# Altium schematic sheet isg_eos_control_board_xem3001.SchDoc
size D
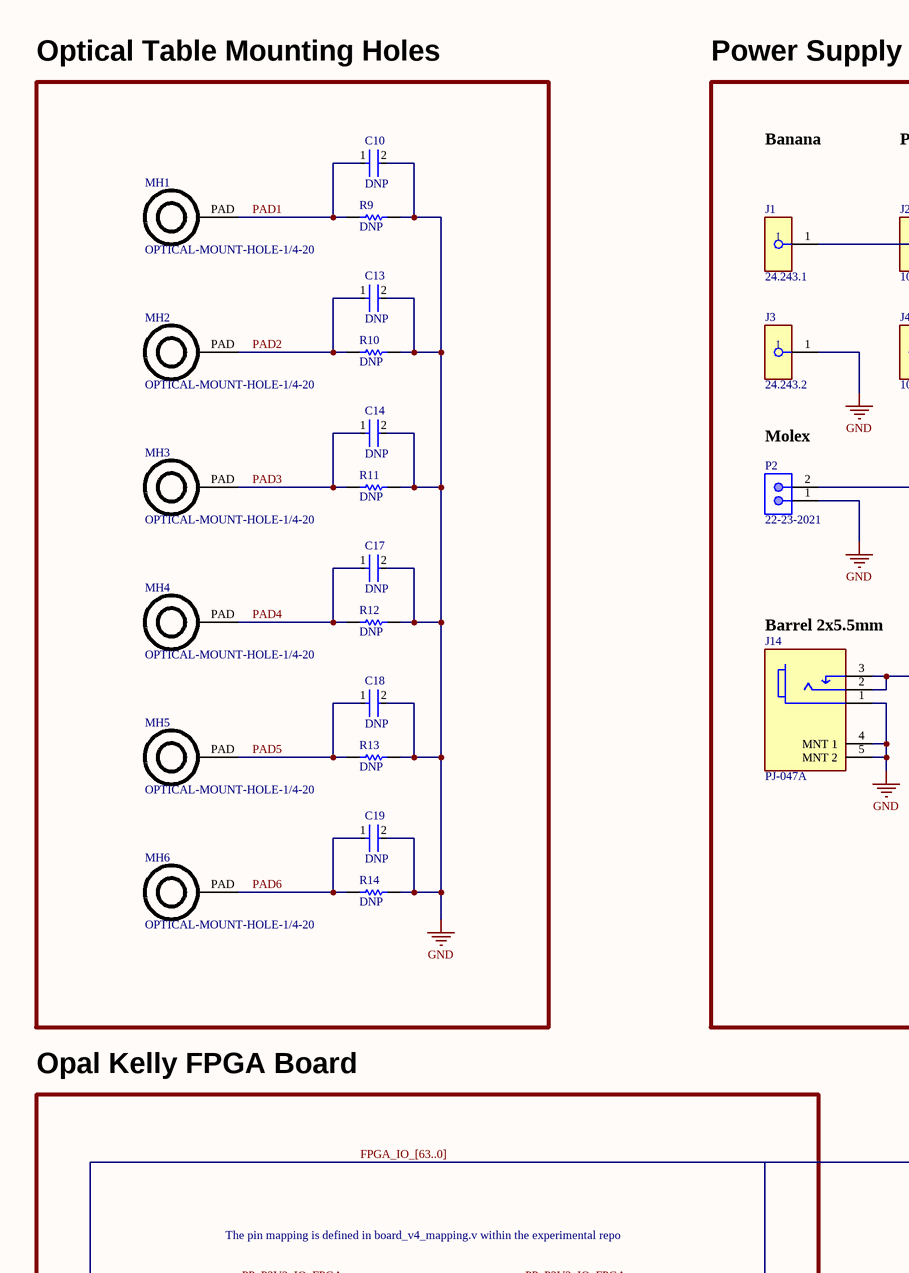
[diagram p0: isg_eos_control_board_xem3001.SchDoc, top left]
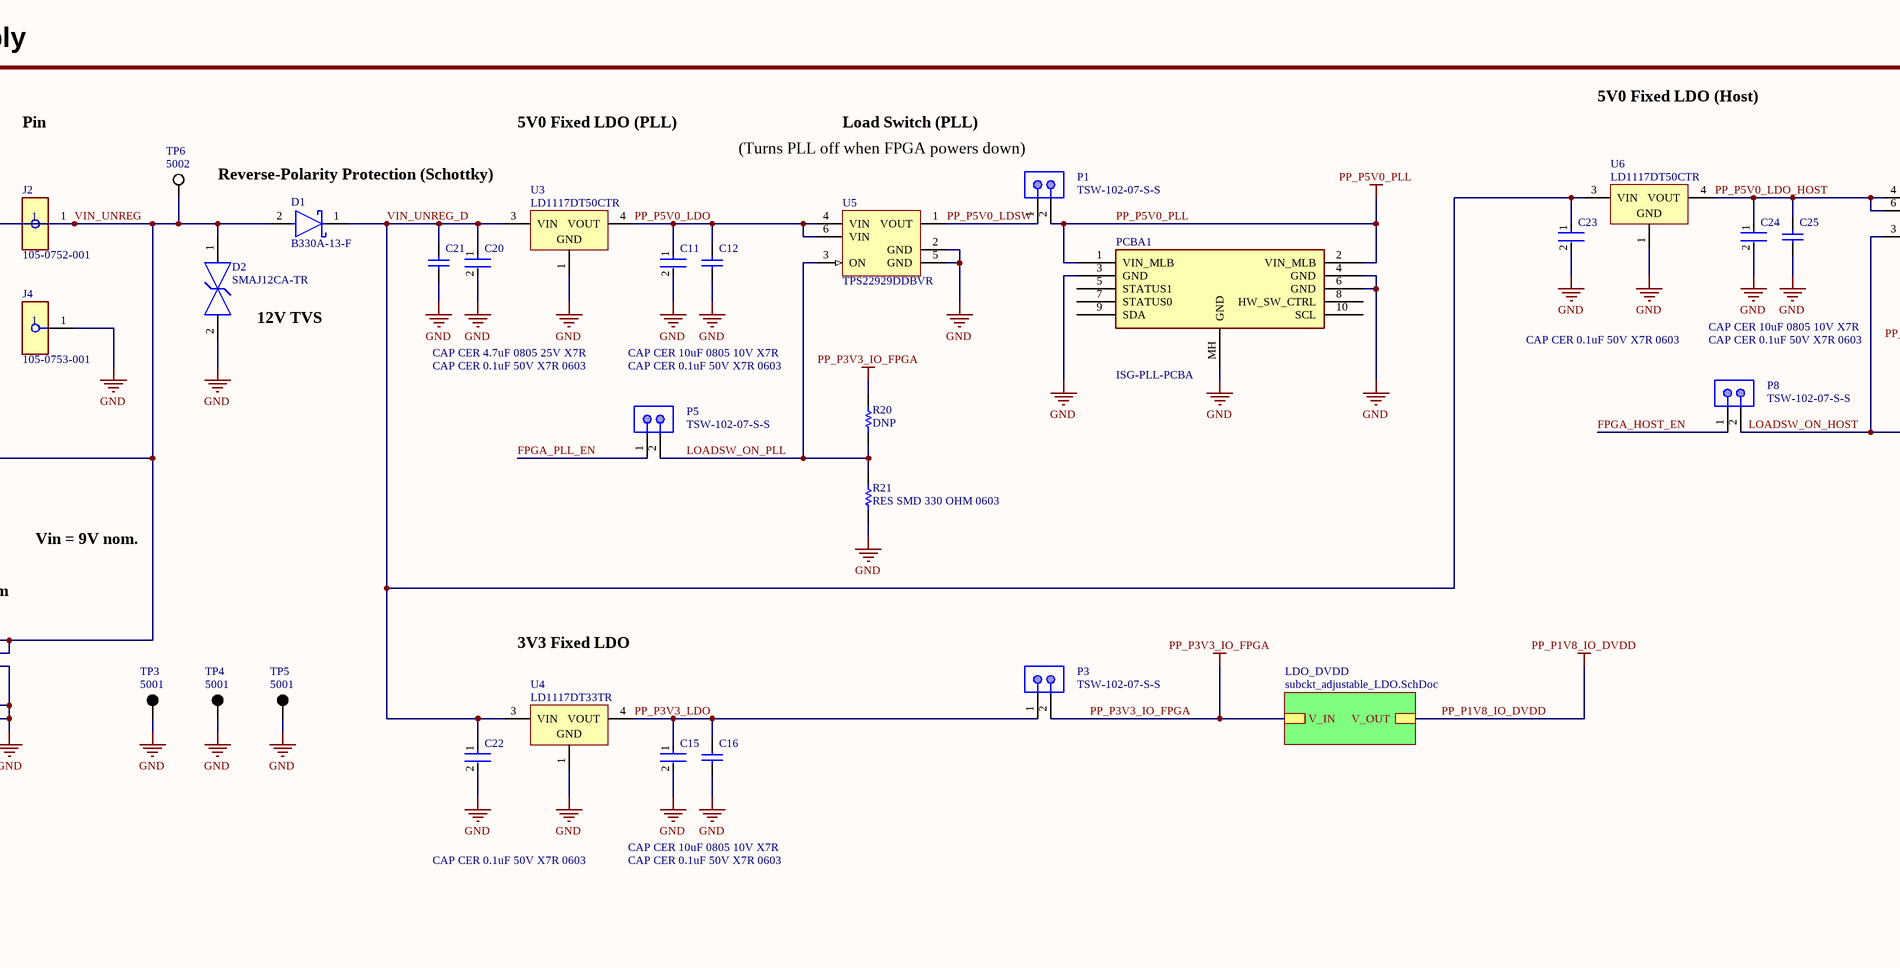
[diagram p1: isg_eos_control_board_xem3001.SchDoc, top middle]
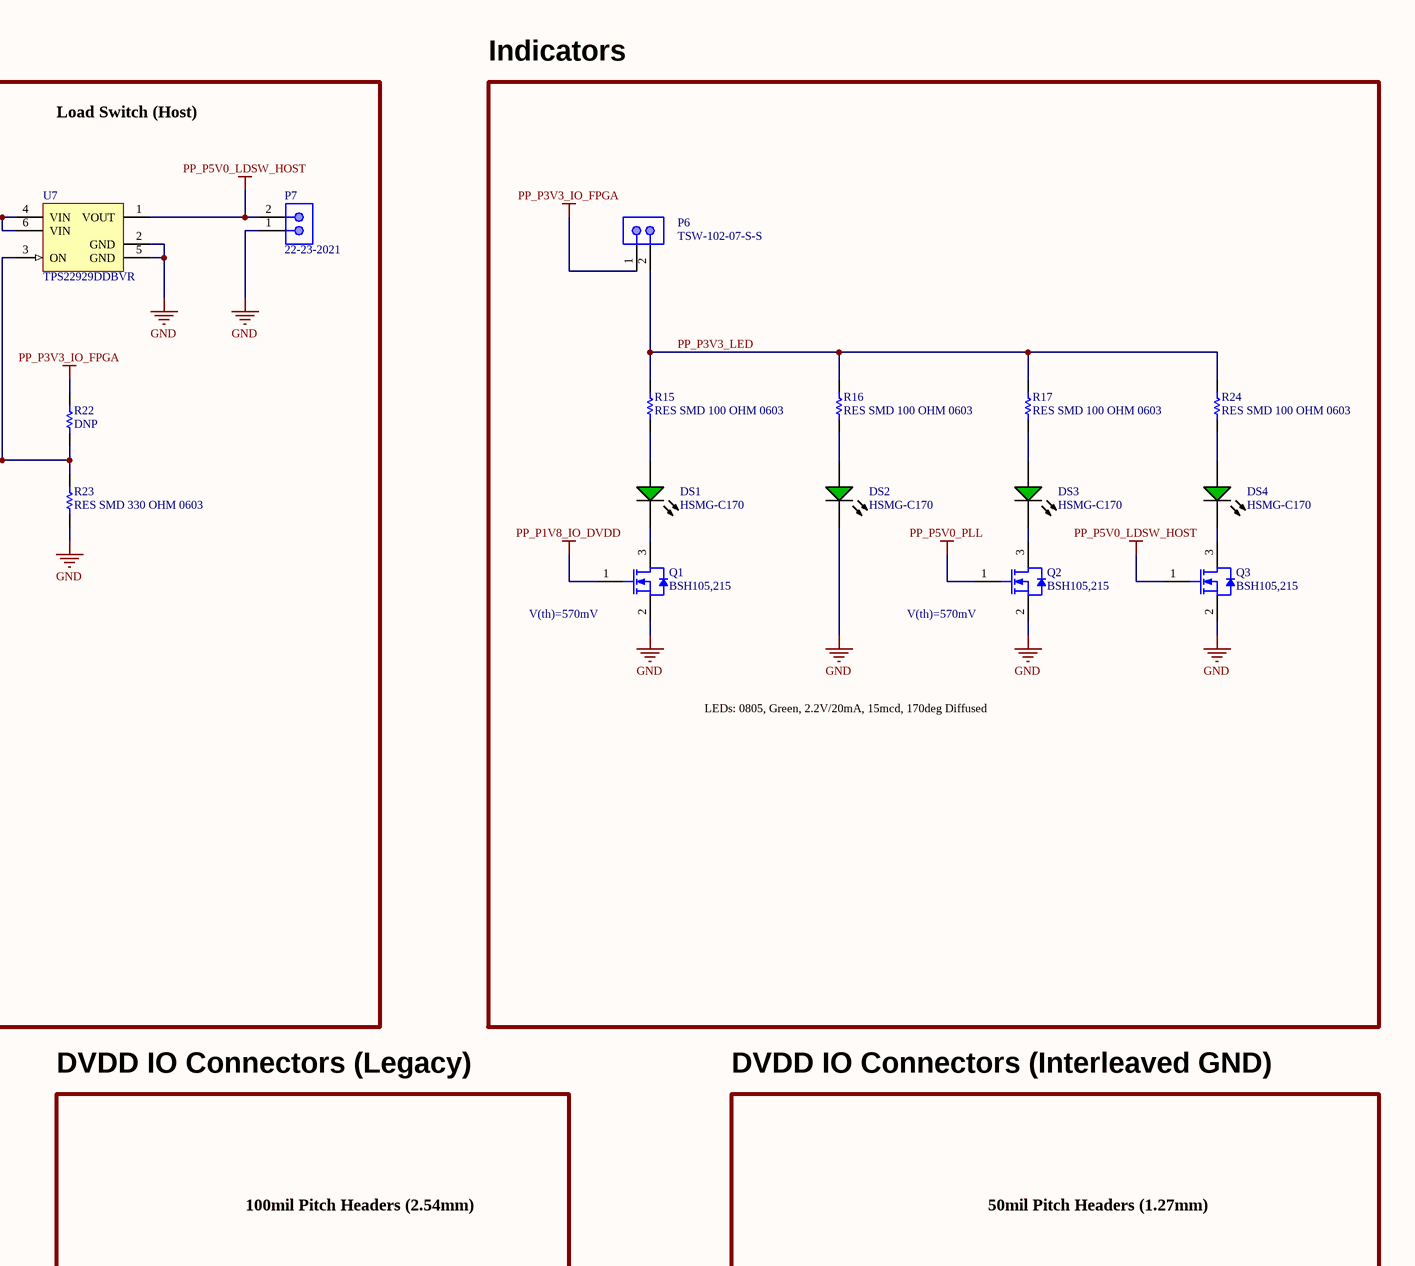
[diagram p2: isg_eos_control_board_xem3001.SchDoc, top right]
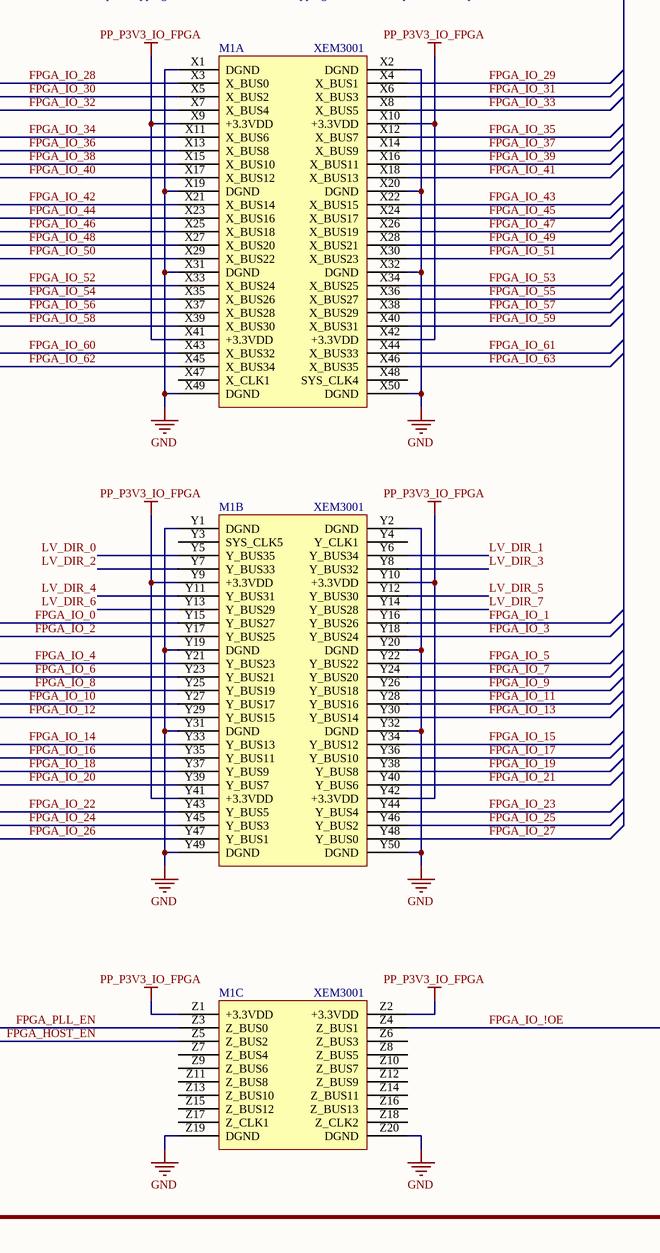
[diagram p3: isg_eos_control_board_xem3001.SchDoc, bottom left]
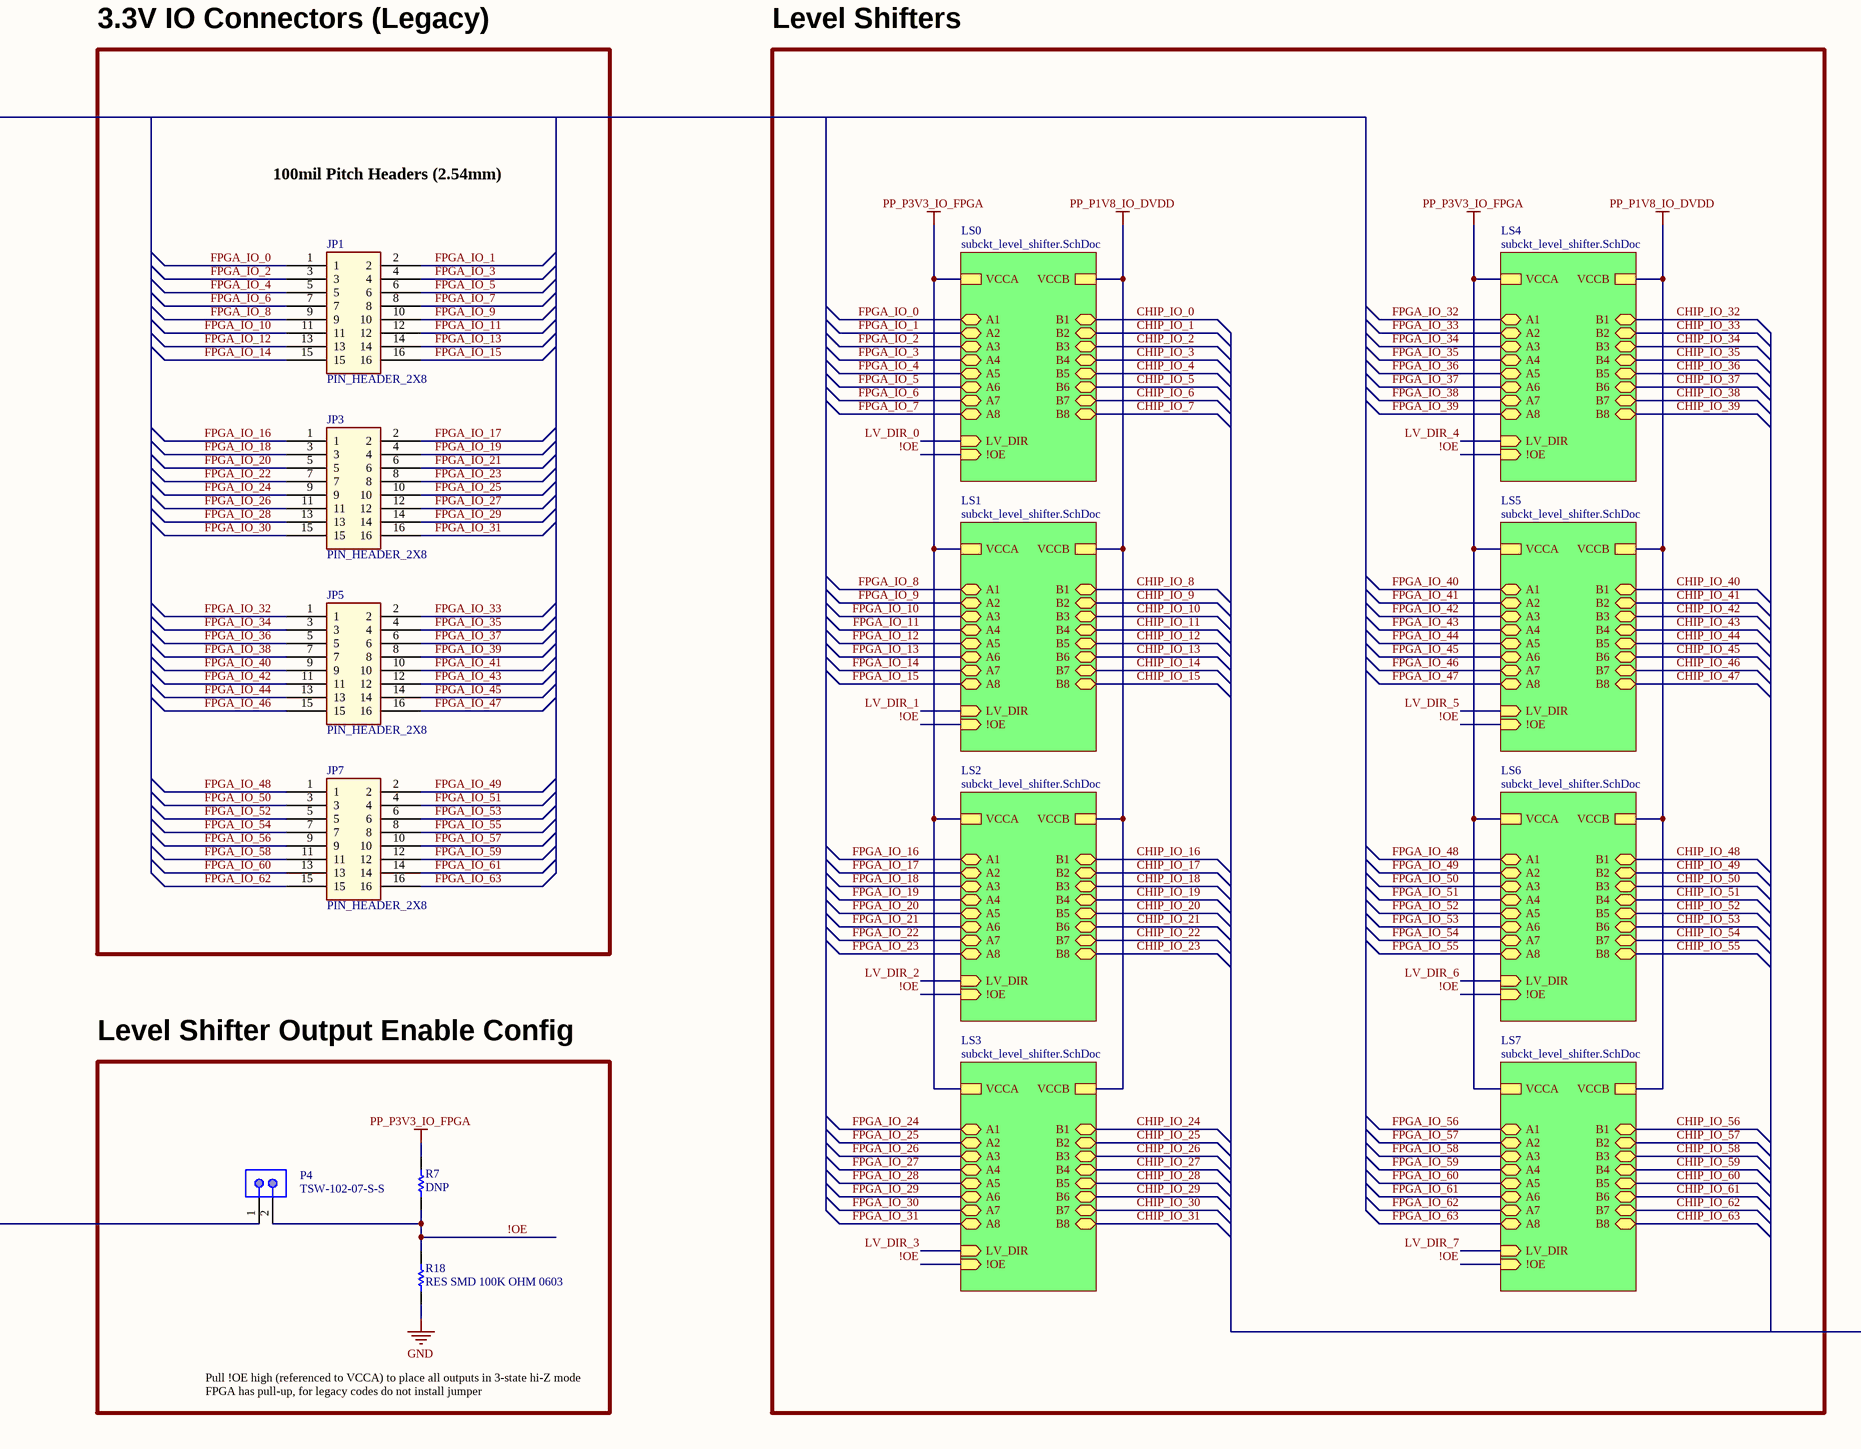
[diagram p4: isg_eos_control_board_xem3001.SchDoc, bottom middle]
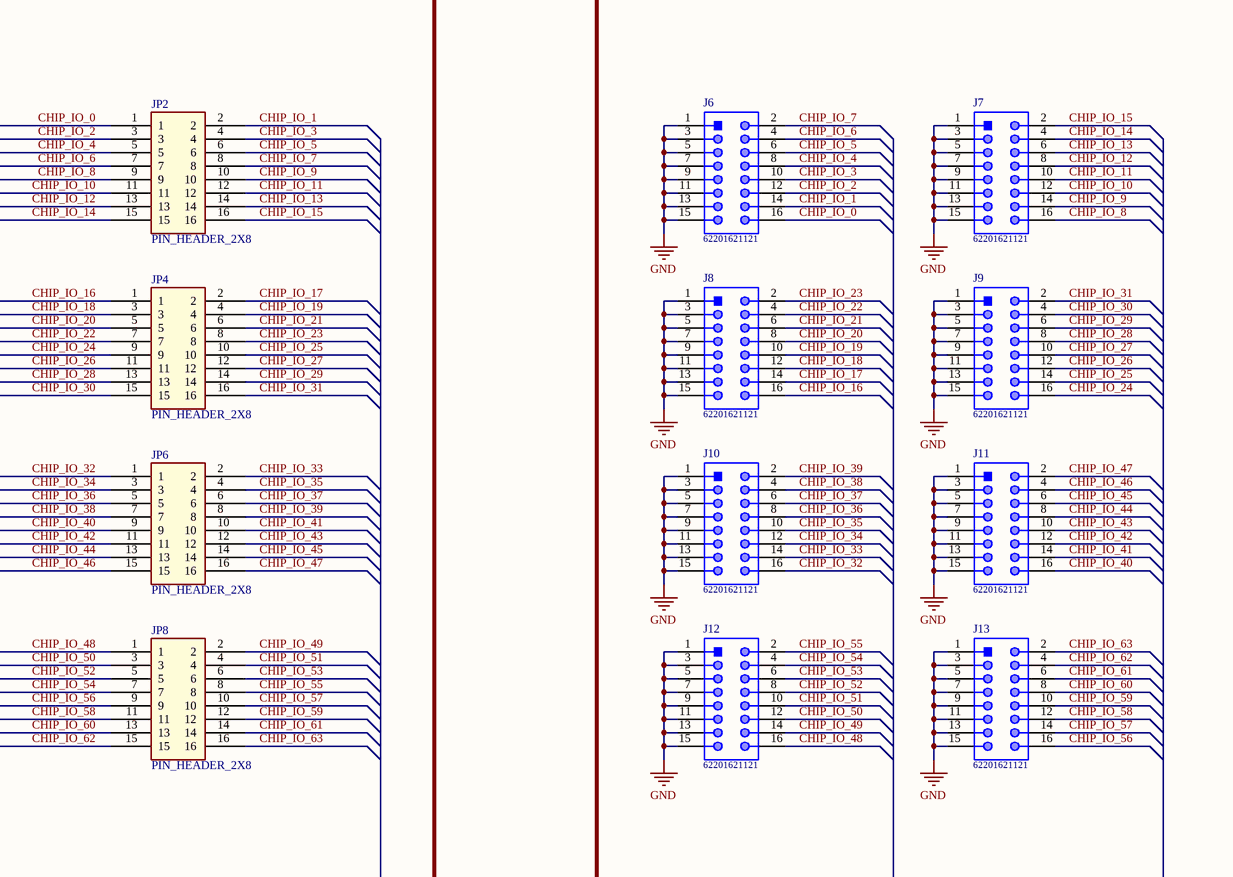
[diagram p5: isg_eos_control_board_xem3001.SchDoc, bottom right]

## Parts
C10  DNP  [FP-CC0603-DA-MFG]
C11  CAP CER 0.1uF 50V X7R 0603  [FP-CC0603-DA-MFG]
C12  CAP CER 10uF 0805 10V X7R  [CAPC2013X140X50NL20T25]
C13  DNP  [FP-CC0603-DA-MFG]
C14  DNP  [FP-CC0603-DA-MFG]
C15  CAP CER 0.1uF 50V X7R 0603  [FP-CC0603-DA-MFG]
C16  CAP CER 10uF 0805 10V X7R  [CAPC2013X140X50NL20T25]
C17  DNP  [FP-CC0603-DA-MFG]
C18  DNP  [FP-CC0603-DA-MFG]
C19  DNP  [FP-CC0603-DA-MFG]
C20  CAP CER 0.1uF 50V X7R 0603  [FP-CC0603-DA-MFG]
C21  CAP CER 4.7uF 0805 25V X7R  [CAPC2013X140X50NL20T25]
C22  CAP CER 0.1uF 50V X7R 0603  [FP-CC0603-DA-MFG]
C23  CAP CER 0.1uF 50V X7R 0603  [FP-CC0603-DA-MFG]
C24  CAP CER 0.1uF 50V X7R 0603  [FP-CC0603-DA-MFG]
C25  CAP CER 10uF 0805 10V X7R  [CAPC2013X140X50NL20T25]
D1  B330A-13-F  [FP-SMA-MFG]
D2  SMAJ12CA-TR  [FP-SMA-CA-MFG]
DS1  HSMG-C170  [AVAG-HSMX-C170_V]
DS2  HSMG-C170  [AVAG-HSMX-C170_V]
DS3  HSMG-C170  [AVAG-HSMX-C170_V]
DS4  HSMG-C170  [AVAG-HSMX-C170_V]
J1  24.243.1  [FP-24_243_1-MFG]
J2  105-0752-001  [FP-105-0751-001-MFG]
J3  24.243.2  [FP-24_243_2-MFG]
J4  105-0753-001  [FP-105-0751-001-MFG]
J6  62201621121  [62201621121]
J7  62201621121  [62201621121]
J8  62201621121  [62201621121]
J9  62201621121  [62201621121]
J10  62201621121  [62201621121]
J11  62201621121  [62201621121]
J12  62201621121  [62201621121]
J13  62201621121  [62201621121]
J14  PJ-047A  [FP-PJ-047A-MFG]
JP1  PIN_HEADER_2X8  [PIN_HEADER_2X8_2.54MM]
JP2  PIN_HEADER_2X8  [PIN_HEADER_2X8_2.54MM]
JP3  PIN_HEADER_2X8  [PIN_HEADER_2X8_2.54MM]
JP4  PIN_HEADER_2X8  [PIN_HEADER_2X8_2.54MM]
JP5  PIN_HEADER_2X8  [PIN_HEADER_2X8_2.54MM]
JP6  PIN_HEADER_2X8  [PIN_HEADER_2X8_2.54MM]
JP7  PIN_HEADER_2X8  [PIN_HEADER_2X8_2.54MM]
JP8  PIN_HEADER_2X8  [PIN_HEADER_2X8_2.54MM]
M1  XEM3001  [XEM3001MODULE]  (parts A,B,C of 3)
MH1  OPTICAL-MOUNT-HOLE-1/4-20  [MH-1/4-20]
MH2  OPTICAL-MOUNT-HOLE-1/4-20  [MH-1/4-20]
MH3  OPTICAL-MOUNT-HOLE-1/4-20  [MH-1/4-20]
MH4  OPTICAL-MOUNT-HOLE-1/4-20  [MH-1/4-20]
MH5  OPTICAL-MOUNT-HOLE-1/4-20  [MH-1/4-20]
MH6  OPTICAL-MOUNT-HOLE-1/4-20  [MH-1/4-20]
P1  TSW-102-07-S-S  [SMTC-TSW-102-07-S-S]
P2  22-23-2021  [MOLX-22-23-2021_V]
P3  TSW-102-07-S-S  [SMTC-TSW-102-07-S-S]
P4  TSW-102-07-S-S  [SMTC-TSW-102-07-S-S]
P5  TSW-102-07-S-S  [SMTC-TSW-102-07-S-S]
P6  TSW-102-07-S-S  [SMTC-TSW-102-07-S-S]
P7  22-23-2021  [MOLX-22-23-2021_V]
P8  TSW-102-07-S-S  [SMTC-TSW-102-07-S-S]
PCBA1  ISG-PLL-PCBA  [ISG-PLL-PCBA]
Q1  BSH105,215  [NXP-SOT23_M]
Q2  BSH105,215  [NXP-SOT23_M]
Q3  BSH105,215  [NXP-SOT23_M]
R7  DNP  [RESC1609X50X30LL10T20]
R9  DNP  [RESC1609X50X30LL10T20]
R10  DNP  [RESC1609X50X30LL10T20]
R11  DNP  [RESC1609X50X30LL10T20]
R12  DNP  [RESC1609X50X30LL10T20]
R13  DNP  [RESC1609X50X30LL10T20]
R14  DNP  [RESC1609X50X30LL10T20]
R15  RES SMD 100 OHM 0603  [RESC1609X50X30LL10T20]
R16  RES SMD 100 OHM 0603  [RESC1609X50X30LL10T20]
R17  RES SMD 100 OHM 0603  [RESC1609X50X30LL10T20]
R18  RES SMD 100K OHM 0603  [RESC1609X50X30LL10T20]
R20  DNP  [RESC1609X50X30LL10T20]
R21  RES SMD 330 OHM 0603  [RESC1609X50X30LL10T20]
R22  DNP  [RESC1609X50X30LL10T20]
R23  RES SMD 330 OHM 0603  [RESC1609X50X30LL10T20]
R24  RES SMD 100 OHM 0603  [RESC1609X50X30LL10T20]
TP3  5001  [KSTN-5001]
TP4  5001  [KSTN-5001]
TP5  5001  [KSTN-5001]
TP6  5002  [KSTN-5002]
U3  LD1117DT50CTR  [TO-252_N]
U4  LD1117DT33TR  [TO-252_N]
U5  TPS22929DDBVR  [DBV0006A_M]
U6  LD1117DT50CTR  [TO-252_N]
U7  TPS22929DDBVR  [DBV0006A_M]

## Blocks framed on the sheet
Optical Table Mounting Holes: C10 C13 C14 C17-C19 MH1-MH6 R9-R14
Power Supply: C11 C12 C15 C16 C20-C25 D1 D2 J1-J4 J14 P1-P3 P5 P7 P8 PCBA1 R20-R23 TP3-TP6 U3-U7
Indicators: DS1-DS4 P6 Q1-Q3 R15-R17 R24
Opal Kelly FPGA Board: M1
3.3V IO Connectors (Legacy): JP1 JP3 JP5 JP7
DVDD IO Connectors (Legacy): JP2 JP4 JP6 JP8
DVDD IO Connectors (Interleaved GND): J6-J13
Level Shifter Output Enable Config: P4 R7 R18

## Sub-sheets
LDO_DVDD = subckt_adjustable_LDO.SchDoc: V_IN, V_OUT
LS0 = subckt_level_shifter.SchDoc: A1 (bidir), A2 (bidir), A3 (bidir), A4 (bidir), A5 (bidir), A6 (bidir), A7 (bidir), A8 (bidir), LV_DIR (in), !OE (in), VCCA, VCCB, B1 (bidir), B2 (bidir), B3 (bidir), B4 (bidir), B5 (bidir), B6 (bidir), B7 (bidir), B8 (bidir)
LS1 = subckt_level_shifter.SchDoc: A1 (bidir), A2 (bidir), A3 (bidir), A4 (bidir), A5 (bidir), A6 (bidir), A7 (bidir), A8 (bidir), LV_DIR (in), !OE (in), VCCA, VCCB, B1 (bidir), B2 (bidir), B3 (bidir), B4 (bidir), B5 (bidir), B6 (bidir), B7 (bidir), B8 (bidir)
LS2 = subckt_level_shifter.SchDoc: A1 (bidir), A2 (bidir), A3 (bidir), A4 (bidir), A5 (bidir), A6 (bidir), A7 (bidir), A8 (bidir), LV_DIR (in), !OE (in), VCCA, VCCB, B1 (bidir), B2 (bidir), B3 (bidir), B4 (bidir), B5 (bidir), B6 (bidir), B7 (bidir), B8 (bidir)
LS3 = subckt_level_shifter.SchDoc: A1 (bidir), A2 (bidir), A3 (bidir), A4 (bidir), A5 (bidir), A6 (bidir), A7 (bidir), A8 (bidir), LV_DIR (in), !OE (in), VCCA, VCCB, B1 (bidir), B2 (bidir), B3 (bidir), B4 (bidir), B5 (bidir), B6 (bidir), B7 (bidir), B8 (bidir)
LS4 = subckt_level_shifter.SchDoc: A1 (bidir), A2 (bidir), A3 (bidir), A4 (bidir), A5 (bidir), A6 (bidir), A7 (bidir), A8 (bidir), LV_DIR (in), !OE (in), VCCA, VCCB, B1 (bidir), B2 (bidir), B3 (bidir), B4 (bidir), B5 (bidir), B6 (bidir), B7 (bidir), B8 (bidir)
LS5 = subckt_level_shifter.SchDoc: A1 (bidir), A2 (bidir), A3 (bidir), A4 (bidir), A5 (bidir), A6 (bidir), A7 (bidir), A8 (bidir), LV_DIR (in), !OE (in), VCCA, VCCB, B1 (bidir), B2 (bidir), B3 (bidir), B4 (bidir), B5 (bidir), B6 (bidir), B7 (bidir), B8 (bidir)
LS6 = subckt_level_shifter.SchDoc: A1 (bidir), A2 (bidir), A3 (bidir), A4 (bidir), A5 (bidir), A6 (bidir), A7 (bidir), A8 (bidir), LV_DIR (in), !OE (in), VCCA, VCCB, B1 (bidir), B2 (bidir), B3 (bidir), B4 (bidir), B5 (bidir), B6 (bidir), B7 (bidir), B8 (bidir)
LS7 = subckt_level_shifter.SchDoc: A1 (bidir), A2 (bidir), A3 (bidir), A4 (bidir), A5 (bidir), A6 (bidir), A7 (bidir), A8 (bidir), LV_DIR (in), !OE (in), VCCA, VCCB, B1 (bidir), B2 (bidir), B3 (bidir), B4 (bidir), B5 (bidir), B6 (bidir), B7 (bidir), B8 (bidir)

## Nets
GND: C10.2 C11.2 C12.2 C13.2 C14.2 C15.2 C16.2 C17.2 C18.2 C19.2 C20.2 C21.2 C22.2 C23.2 C24.2 C25.2 D2.2 DS2.2(K) J3.1 J4.1 J6.1 J6.3 J6.5 J6.7 J6.9 J6.11 J6.13 J6.15 J7.1 J7.3 J7.5 J7.7 J7.9 J7.11 J7.13 J7.15 J8.1 J8.3 J8.5 J8.7 J8.9 J8.11 J8.13 J8.15 J9.1 J9.3 J9.5 J9.7 J9.9 J9.11 J9.13 J9.15 J10.1 J10.3 J10.5 J10.7 J10.9 J10.11 J10.13 J10.15 J11.1 J11.3 J11.5 J11.7 J11.9 J11.11 J11.13 J11.15 J12.1 J12.3 J12.5 J12.7 J12.9 J12.11 J12.13 J12.15 J13.1 J13.3 J13.5 J13.7 J13.9 J13.11 J13.13 J13.15 J14.1 J14.4(MNT_1) J14.5(MNT_2) M1.X1(DGND) M1.X2(DGND) M1.X19(DGND) M1.X20(DGND) M1.X31(DGND) M1.X32(DGND) M1.X49(DGND) M1.X50(DGND) M1.Y1(DGND) M1.Y2(DGND) M1.Y19(DGND) M1.Y20(DGND) M1.Y31(DGND) M1.Y32(DGND) M1.Y49(DGND) M1.Y50(DGND) M1.Z19(DGND) M1.Z20(DGND) P2.1 P7.1 PCBA1.3(GND) PCBA1.4(GND) PCBA1.6(GND) PCBA1.MH(GND) Q1.2(S) Q2.2(S) Q3.2(S) R9.2 R10.2 R11.2 R12.2 R13.2 R14.2 R18.2 R21.2 R23.2 TP3.1 TP4.1 TP5.1 U3.1(GND) U4.1(GND) U5.2(GND) U5.5(GND) U6.1(GND) U7.2(GND) U7.5(GND)
PP_P1V8_IO_DVDD: Q1.1(G) ; sheet LDO_DVDD/V_OUT, sheet LS0/VCCB, sheet LS1/VCCB, sheet LS2/VCCB, sheet LS3/VCCB, sheet LS4/VCCB, sheet LS5/VCCB, sheet LS6/VCCB, sheet LS7/VCCB
PP_P3V3_IO_FPGA: M1.X9(+3.3VDD) M1.X10(+3.3VDD) M1.X41(+3.3VDD) M1.X42(+3.3VDD) M1.Y9(+3.3VDD) M1.Y10(+3.3VDD) M1.Y41(+3.3VDD) M1.Y42(+3.3VDD) M1.Z1(+3.3VDD) M1.Z2(+3.3VDD) P3.2 P6.1 R7.1 R20.1 R22.1 ; sheet LDO_DVDD/V_IN, sheet LS0/VCCA, sheet LS1/VCCA, sheet LS2/VCCA, sheet LS3/VCCA, sheet LS4/VCCA, sheet LS5/VCCA, sheet LS6/VCCA, sheet LS7/VCCA
PP_P5V0_LDSW_HOST: P7.2 Q3.1(G) U7.1(VOUT)
PP_P5V0_PLL: P1.2 PCBA1.1(VIN_MLB) PCBA1.2(VIN_MLB) Q2.1(G)
!OE: P4.2 R7.2 R18.1 ; sheet LS0/!OE, sheet LS1/!OE, sheet LS2/!OE, sheet LS3/!OE, sheet LS4/!OE, sheet LS5/!OE, sheet LS6/!OE, sheet LS7/!OE
CHIP_IO_0: J6.16 JP2.1 ; sheet LS0/B1
CHIP_IO_1: J6.14 JP2.2 ; sheet LS0/B2
CHIP_IO_2: J6.12 JP2.3 ; sheet LS0/B3
CHIP_IO_3: J6.10 JP2.4 ; sheet LS0/B4
CHIP_IO_4: J6.8 JP2.5 ; sheet LS0/B5
CHIP_IO_5: J6.6 JP2.6 ; sheet LS0/B6
CHIP_IO_6: J6.4 JP2.7 ; sheet LS0/B7
CHIP_IO_7: J6.2 JP2.8 ; sheet LS0/B8
CHIP_IO_8: J7.16 JP2.9 ; sheet LS1/B1
CHIP_IO_9: J7.14 JP2.10 ; sheet LS1/B2
CHIP_IO_10: J7.12 JP2.11 ; sheet LS1/B3
CHIP_IO_11: J7.10 JP2.12 ; sheet LS1/B4
CHIP_IO_12: J7.8 JP2.13 ; sheet LS1/B5
CHIP_IO_13: J7.6 JP2.14 ; sheet LS1/B6
CHIP_IO_14: J7.4 JP2.15 ; sheet LS1/B7
CHIP_IO_15: J7.2 JP2.16 ; sheet LS1/B8
CHIP_IO_16: J8.16 JP4.1 ; sheet LS2/B1
CHIP_IO_17: J8.14 JP4.2 ; sheet LS2/B2
CHIP_IO_18: J8.12 JP4.3 ; sheet LS2/B3
CHIP_IO_19: J8.10 JP4.4 ; sheet LS2/B4
CHIP_IO_20: J8.8 JP4.5 ; sheet LS2/B5
CHIP_IO_21: J8.6 JP4.6 ; sheet LS2/B6
CHIP_IO_22: J8.4 JP4.7 ; sheet LS2/B7
CHIP_IO_23: J8.2 JP4.8 ; sheet LS2/B8
CHIP_IO_24: J9.16 JP4.9 ; sheet LS3/B1
CHIP_IO_25: J9.14 JP4.10 ; sheet LS3/B2
CHIP_IO_26: J9.12 JP4.11 ; sheet LS3/B3
CHIP_IO_27: J9.10 JP4.12 ; sheet LS3/B4
CHIP_IO_28: J9.8 JP4.13 ; sheet LS3/B5
CHIP_IO_29: J9.6 JP4.14 ; sheet LS3/B6
CHIP_IO_30: J9.4 JP4.15 ; sheet LS3/B7
CHIP_IO_31: J9.2 JP4.16 ; sheet LS3/B8
CHIP_IO_32: J10.16 JP6.1 ; sheet LS4/B1
CHIP_IO_33: J10.14 JP6.2 ; sheet LS4/B2
CHIP_IO_34: J10.12 JP6.3 ; sheet LS4/B3
CHIP_IO_35: J10.10 JP6.4 ; sheet LS4/B4
CHIP_IO_36: J10.8 JP6.5 ; sheet LS4/B5
CHIP_IO_37: J10.6 JP6.6 ; sheet LS4/B6
CHIP_IO_38: J10.4 JP6.7 ; sheet LS4/B7
CHIP_IO_39: J10.2 JP6.8 ; sheet LS4/B8
CHIP_IO_40: J11.16 JP6.9 ; sheet LS5/B1
CHIP_IO_41: J11.14 JP6.10 ; sheet LS5/B2
CHIP_IO_42: J11.12 JP6.11 ; sheet LS5/B3
CHIP_IO_43: J11.10 JP6.12 ; sheet LS5/B4
CHIP_IO_44: J11.8 JP6.13 ; sheet LS5/B5
CHIP_IO_45: J11.6 JP6.14 ; sheet LS5/B6
CHIP_IO_46: J11.4 JP6.15 ; sheet LS5/B7
CHIP_IO_47: J11.2 JP6.16 ; sheet LS5/B8
CHIP_IO_48: J12.16 JP8.1 ; sheet LS6/B1
CHIP_IO_49: J12.14 JP8.2 ; sheet LS6/B2
CHIP_IO_50: J12.12 JP8.3 ; sheet LS6/B3
CHIP_IO_51: J12.10 JP8.4 ; sheet LS6/B4
CHIP_IO_52: J12.8 JP8.5 ; sheet LS6/B5
CHIP_IO_53: J12.6 JP8.6 ; sheet LS6/B6
CHIP_IO_54: J12.4 JP8.7 ; sheet LS6/B7
CHIP_IO_55: J12.2 JP8.8 ; sheet LS6/B8
CHIP_IO_56: J13.16 JP8.9 ; sheet LS7/B1
CHIP_IO_57: J13.14 JP8.10 ; sheet LS7/B2
CHIP_IO_58: J13.12 JP8.11 ; sheet LS7/B3
CHIP_IO_59: J13.10 JP8.12 ; sheet LS7/B4
CHIP_IO_60: J13.8 JP8.13 ; sheet LS7/B5
CHIP_IO_61: J13.6 JP8.14 ; sheet LS7/B6
CHIP_IO_62: J13.4 JP8.15 ; sheet LS7/B7
CHIP_IO_63: J13.2 JP8.16 ; sheet LS7/B8
FPGA_HOST_EN: M1.Z5(Z_BUS2) P8.1
FPGA_IO_0: JP1.1 M1.Y15(Y_BUS27) ; sheet LS0/A1
FPGA_IO_1: JP1.2 M1.Y16(Y_BUS26) ; sheet LS0/A2
FPGA_IO_2: JP1.3 M1.Y17(Y_BUS25) ; sheet LS0/A3
FPGA_IO_3: JP1.4 M1.Y18(Y_BUS24) ; sheet LS0/A4
FPGA_IO_4: JP1.5 M1.Y21(Y_BUS23) ; sheet LS0/A5
FPGA_IO_5: JP1.6 M1.Y22(Y_BUS22) ; sheet LS0/A6
FPGA_IO_6: JP1.7 M1.Y23(Y_BUS21) ; sheet LS0/A7
FPGA_IO_7: JP1.8 M1.Y24(Y_BUS20) ; sheet LS0/A8
FPGA_IO_8: JP1.9 M1.Y25(Y_BUS19) ; sheet LS1/A1
FPGA_IO_9: JP1.10 M1.Y26(Y_BUS18) ; sheet LS1/A2
FPGA_IO_10: JP1.11 M1.Y27(Y_BUS17) ; sheet LS1/A3
FPGA_IO_11: JP1.12 M1.Y28(Y_BUS16) ; sheet LS1/A4
FPGA_IO_12: JP1.13 M1.Y29(Y_BUS15) ; sheet LS1/A5
FPGA_IO_13: JP1.14 M1.Y30(Y_BUS14) ; sheet LS1/A6
FPGA_IO_14: JP1.15 M1.Y33(Y_BUS13) ; sheet LS1/A7
FPGA_IO_15: JP1.16 M1.Y34(Y_BUS12) ; sheet LS1/A8
FPGA_IO_16: JP3.1 M1.Y35(Y_BUS11) ; sheet LS2/A1
FPGA_IO_17: JP3.2 M1.Y36(Y_BUS10) ; sheet LS2/A2
FPGA_IO_18: JP3.3 M1.Y37(Y_BUS9) ; sheet LS2/A3
FPGA_IO_19: JP3.4 M1.Y38(Y_BUS8) ; sheet LS2/A4
FPGA_IO_20: JP3.5 M1.Y39(Y_BUS7) ; sheet LS2/A5
FPGA_IO_21: JP3.6 M1.Y40(Y_BUS6) ; sheet LS2/A6
FPGA_IO_22: JP3.7 M1.Y43(Y_BUS5) ; sheet LS2/A7
FPGA_IO_23: JP3.8 M1.Y44(Y_BUS4) ; sheet LS2/A8
FPGA_IO_24: JP3.9 M1.Y45(Y_BUS3) ; sheet LS3/A1
FPGA_IO_25: JP3.10 M1.Y46(Y_BUS2) ; sheet LS3/A2
FPGA_IO_26: JP3.11 M1.Y47(Y_BUS1) ; sheet LS3/A3
FPGA_IO_27: JP3.12 M1.Y48(Y_BUS0) ; sheet LS3/A4
FPGA_IO_28: JP3.13 M1.X3(X_BUS0) ; sheet LS3/A5
FPGA_IO_29: JP3.14 M1.X4(X_BUS1) ; sheet LS3/A6
FPGA_IO_30: JP3.15 M1.X5(X_BUS2) ; sheet LS3/A7
FPGA_IO_31: JP3.16 M1.X6(X_BUS3) ; sheet LS3/A8
FPGA_IO_32: JP5.1 M1.X7(X_BUS4) ; sheet LS4/A1
FPGA_IO_33: JP5.2 M1.X8(X_BUS5) ; sheet LS4/A2
FPGA_IO_34: JP5.3 M1.X11(X_BUS6) ; sheet LS4/A3
FPGA_IO_35: JP5.4 M1.X12(X_BUS7) ; sheet LS4/A4
FPGA_IO_36: JP5.5 M1.X13(X_BUS8) ; sheet LS4/A5
FPGA_IO_37: JP5.6 M1.X14(X_BUS9) ; sheet LS4/A6
FPGA_IO_38: JP5.7 M1.X15(X_BUS10) ; sheet LS4/A7
FPGA_IO_39: JP5.8 M1.X16(X_BUS11) ; sheet LS4/A8
FPGA_IO_40: JP5.9 M1.X17(X_BUS12) ; sheet LS5/A1
FPGA_IO_41: JP5.10 M1.X18(X_BUS13) ; sheet LS5/A2
FPGA_IO_42: JP5.11 M1.X21(X_BUS14) ; sheet LS5/A3
FPGA_IO_43: JP5.12 M1.X22(X_BUS15) ; sheet LS5/A4
FPGA_IO_44: JP5.13 M1.X23(X_BUS16) ; sheet LS5/A5
FPGA_IO_45: JP5.14 M1.X24(X_BUS17) ; sheet LS5/A6
FPGA_IO_46: JP5.15 M1.X25(X_BUS18) ; sheet LS5/A7
FPGA_IO_47: JP5.16 M1.X26(X_BUS19) ; sheet LS5/A8
FPGA_IO_48: JP7.1 M1.X27(X_BUS20) ; sheet LS6/A1
FPGA_IO_49: JP7.2 M1.X28(X_BUS21) ; sheet LS6/A2
FPGA_IO_50: JP7.3 M1.X29(X_BUS22) ; sheet LS6/A3
FPGA_IO_51: JP7.4 M1.X30(X_BUS23) ; sheet LS6/A4
FPGA_IO_52: JP7.5 M1.X33(X_BUS24) ; sheet LS6/A5
FPGA_IO_53: JP7.6 M1.X34(X_BUS25) ; sheet LS6/A6
FPGA_IO_54: JP7.7 M1.X35(X_BUS26) ; sheet LS6/A7
FPGA_IO_55: JP7.8 M1.X36(X_BUS27) ; sheet LS6/A8
FPGA_IO_56: JP7.9 M1.X37(X_BUS28) ; sheet LS7/A1
FPGA_IO_57: JP7.10 M1.X38(X_BUS29) ; sheet LS7/A2
FPGA_IO_58: JP7.11 M1.X39(X_BUS30) ; sheet LS7/A3
FPGA_IO_59: JP7.12 M1.X40(X_BUS31) ; sheet LS7/A4
FPGA_IO_60: JP7.13 M1.X43(X_BUS32) ; sheet LS7/A5
FPGA_IO_61: JP7.14 M1.X44(X_BUS33) ; sheet LS7/A6
FPGA_IO_62: JP7.15 M1.X45(X_BUS34) ; sheet LS7/A7
FPGA_IO_63: JP7.16 M1.X46(X_BUS35) ; sheet LS7/A8
FPGA_IO_!OE: M1.Z4(Z_BUS1) P4.1
FPGA_PLL_EN: M1.Z3(Z_BUS0) P5.1
LOADSW_ON_HOST: P8.2 R22.2 R23.1 U7.3(ON)
LOADSW_ON_PLL: P5.2 R20.2 R21.1 U5.3(ON)
LV_DIR_0: M1.Y5(Y_BUS35) ; sheet LS0/LV_DIR
LV_DIR_1: M1.Y6(Y_BUS34) ; sheet LS1/LV_DIR
LV_DIR_2: M1.Y7(Y_BUS33) ; sheet LS2/LV_DIR
LV_DIR_3: M1.Y8(Y_BUS32) ; sheet LS3/LV_DIR
LV_DIR_4: M1.Y11(Y_BUS31) ; sheet LS4/LV_DIR
LV_DIR_5: M1.Y12(Y_BUS30) ; sheet LS5/LV_DIR
LV_DIR_6: M1.Y13(Y_BUS29) ; sheet LS6/LV_DIR
LV_DIR_7: M1.Y14(Y_BUS28) ; sheet LS7/LV_DIR
PAD1: C10.1 MH1.PAD R9.1
PAD2: C13.1 MH2.PAD R10.1
PAD3: C14.1 MH3.PAD R11.1
PAD4: C17.1 MH4.PAD R12.1
PAD5: C18.1 MH5.PAD R13.1
PAD6: C19.1 MH6.PAD R14.1
PP_P3V3_LDO: C15.1 C16.1 P3.1 U4.4(VOUT)
PP_P3V3_LED: P6.2 R15.2 R16.2 R17.2 R24.2
PP_P5V0_LDO: C11.1 C12.1 U3.4(VOUT) U5.4(VIN) U5.6(VIN)
PP_P5V0_LDO_HOST: C24.1 C25.1 U6.4(VOUT) U7.4(VIN) U7.6(VIN)
PP_P5V0_LDSW: P1.1 U5.1(VOUT)
VIN_UNREG: D1.2(A) D2.1 J1.1 J2.1 J14.2 J14.3 P2.2 TP6.1
VIN_UNREG_D: C20.1 C21.1 C22.1 C23.1 D1.1(C) U3.3(VIN) U4.3(VIN) U6.3(VIN)
NetDS1_1: DS1.1(A) R15.1
NetDS1_2: DS1.2(K) Q1.3(D)
NetDS2_1: DS2.1(A) R16.1
NetDS3_1: DS3.1(A) R17.1
NetDS3_2: DS3.2(K) Q2.3(D)
NetDS4_1: DS4.1(A) R24.1
NetDS4_2: DS4.2(K) Q3.3(D)

Not connected (* = marked no-connect by the designer): M1 X47(X_CLK1) X48(SYS_CLK4) Y3(SYS_CLK5) Y4(Y_CLK1) Z6(Z_BUS3) Z7(Z_BUS4) Z8(Z_BUS5) Z9(Z_BUS6) Z10(Z_BUS7) Z11(Z_BUS8) Z12(Z_BUS9) Z13(Z_BUS10) Z14(Z_BUS11) Z15(Z_BUS12) Z16(Z_BUS13) Z17(Z_CLK1) Z18(Z_CLK2); PCBA1 5(STATUS1) 7(STATUS0) 8(HW_SW_CTRL) 9(SDA) 10(SCL)

## Buses and harness runs
bus FPGA_IO_[63..0]

## Notes on the sheet
- Banana
- Pin
- 5V0 Fixed LDO (PLL)
- (near P1) (Turns PLL off when FPGA powers down)
- Load Switch (PLL)
- 5V0 Fixed LDO (Host)
- Load Switch (Host)
- Reverse-Polarity Protection (Schottky)
- (near D2) 12V TVS
- (near P2) Molex
- Vin = 9V nom.
- (near J14) Barrel 2x5.5mm
- (near Q1) V(th)=570mV
- (near Q2) V(th)=570mV
- 3V3 Fixed LDO
- LEDs: 0805, Green, 2.2V/20mA, 15mcd, 170deg Diffused
- Level Shifters
- The pin mapping is defined in board_v4_mapping.v within the experimental repo
- 100mil Pitch Headers (2.54mm)
- 50mil Pitch Headers (1.27mm)
- Pull !OE high (referenced to VCCA) to place all outputs in 3-state hi-Z mode
- FPGA has pull-up, for legacy codes do not install jumper

## Library data of the parts
C10 C13 C14 C17-C19 = CMP-03422-000030-1: Manufacturer Part Number: CC0603KRX7R7BB104; Manufacturer: YAGEO; Voltage Rating: 16 V; Tolerance: 0.1; Value: 100 nF; Temperature Coefficient: 15%; Temperature Characteristic: X7R; Material: Ceramic; Package: CC0603-DA; ComponentLink2Description: Datasheet; Octopart: https://octopart.com/cc0603krx7r7bb104-yageo-192941; Temperature Range High: +125°C; Digikey Description: CAP CER 0.1UF 16V X7R 0603; Voltage: 16 V; Device Class L2: Capacitors; Height: 0.9mm; Temperature: -55°C to +125°C; Device Class L1: Passive Components; Device Class L3: Ceramic Capacitors; ComponentLink2URL: http://www.yageo.com/documents/recent/UPY-GPHC_X7R_6.3V-to-50V_18.pdf; Footprint Url: http://www.yageo.com/exep/pages/download/literatures/UPY-C_GEN_24.pdf; RoHS: TRUE; Temperature Range Low: -55°C; Lead Free: Yes; Capacitance: 100 nF; Category: Cap; Mouser Description: Multilayer Ceramic Capacitor, CC Series, 0.1 - F, - 10%, X7R, 16 V, 0603 [1608 Metric]; Automotive: No
C11 C15 C20 C22-C24 = CMP-03422-000030-1: Manufacturer Part Number: CC0603KRX7R7BB104; Manufacturer: YAGEO; Voltage Rating: 16 V; Tolerance: 0.1; Value: 100 nF; Temperature Coefficient: 15%; Material: Ceramic; Package: CC0603-DA; ComponentLink2Description: Datasheet; Octopart: https://octopart.com/cc0603krx7r7bb104-yageo-192941; Temperature Range High: +125°C; Digikey Description: CAP CER 0.1UF 16V X7R 0603; Voltage: 16 V; Device Class L2: Capacitors; Height: 0.9mm; Temperature: -55°C to +125°C; Device Class L1: Passive Components; Device Class L3: Ceramic Capacitors; ComponentLink2URL: http://www.yageo.com/documents/recent/UPY-GPHC_X7R_6.3V-to-50V_18.pdf; Footprint Url: http://www.yageo.com/exep/pages/download/literatures/UPY-C_GEN_24.pdf; RoHS: TRUE; Temperature Range Low: -55°C; Temperature Characteristic: X7R; Lead Free: Yes; Capacitance: 100 nF; Category: Cap; Mouser Description: Multilayer Ceramic Capacitor, CC Series, 0.1 - F, - 10%, X7R, 16 V, 0603 [1608 Metric]; Automotive: No
C12 C16 C21 C25 = CMP-2007-04677-1: Part Number: 0805ZC475KAT2A; Manufacturer: AVX Interconnect / Elco
D1 = CMP-2000-05896-2: DIODE SCHOTTKY 30V 3A SMA; Manufacturer: Diodes; Max Junction Temp: +150°C; Standoff Height: 0.05mm; Peak Reverse Current: 0.5mA; Capacitance: 200pF; Value: 200pF; Max Surge Forward Current: 80A; Automotive Grade: Grade 0; Octopart: https://octopart.com/b330a-13-f-diodes+inc.-325808; Working Reverse Voltage: 30V; ComponentLink2URL: https://www.diodes.com/assets/Datasheets/ds30891.pdf; Dc Blocking Voltage: 30V; Reverse Voltage: 30V; Digikey Description: DIODE SCHOTTKY 30V 3A SMA; Device Class L1: Discrete Semiconductors; Temperature: -55°C to +150°C; RoHS: TRUE; Device Class L2: Diodes; Device Class L3: Schottky Diodes; Package: SMA; ComponentLink2Description: Datasheet; Automotive: Yes; Temperature Range High: +150°C; Manufacturer Part Number: B330A-13-F; Lead Free: Yes; Temperature Range Low: -55°C; Max Repetitive Reverse Voltage: 30V; Footprint Url: https://www.diodes.com/assets/Package-Files/SMA.pdf; Forward Current: 3A; Mouser Description: Schottky Diodes & Rectifiers 30V 3A; Height: 2.4mm; Category: Diode
D2 = CMP-12225-000045-1: TVS DIODE 12V 25.3V SMA; Manufacturer: STMicroelectronics; Number Of Channels: 1; Breakdown Voltage: 13.3V; Max Junction Temp: +150°C; Clamping Voltage: 19.9V; Peak Pulse Current: 20.1A; Standoff Height: 0.05mm; Peak Pulse Power: 400W; Direction: Bidirectional; Package: SMA-CA; Octopart: https://octopart.com/smaj12ca-tr-stmicroelectronics-347060; Device Class L3: unset; Automotive: No; Height: 2.65mm; Reverse Standoff Voltage: 12V; Mouser Description: TVS Diodes - Transient Voltage Suppressors 400W 12V Bidirect; Device Class L2: TVS Diodes; Lead Free: Yes; ComponentLink2URL: https://www.st.com/resource/en/datasheet/smaj.pdf; Digikey Description: TVS DIODE 12V 25.3V SMA; Temperature Range High: +150°C; RoHS: TRUE; Device Class L1: Circuit Protection; Temperature Range Low: -55°C; Temperature: -55°C to +150°C; Category: Diode; ComponentLink2Description: Datasheet; Manufacturer Part Number: SMAJ12CA-TR
DS1-DS4 = CMP-2000-05062-1: Chip LED, Green, 2.2 V, -40 to 85 degC, 2-Pin SMD, Pb-Free, Tape and Reel; Manufacturer: Avago; No. of Pins: 2; Peak Wavelength: 570nm; SVHC: NoSVHC(16-Jun-2014); Dominant Wavelength: 572nm; Forward Current If: 20mA; Viewing Angle: 170deg; Lens Shape: Rectangular; PIV Max: 5V; External Width: 1.25mm; LED Type: Standard; External Depth: 0.8mm; Opto Mounting Orientation: Top; Luminous Intensity: 15mcd; Luminous Intensity Min: 4mcd; Forward Voltage VF Max: 2.6V; External Length / Height: 2mm; Bulb Size: 1.25mmx1.4mm; Light Area Height: 1mm; Voltage Vf Typ: 2.2V; Operating Temperature Max: 85degC; Datasheet Version: Oct-08; MSL: MSL2A-4weeks; Peak Forward Current: 20mA; Package Description: 2-Pin Surface Mount Device, Body 2 x 1.25 mm, Height 0.8 mm; Datasheet URL: https://datasheet.ciiva.com/29280/180495-da-01-en-chip-led-hsmg-c170-gelb-gruen-29280971.pdf; Storage Temperature Min: -40degC; LED Colour: Green; Wavelength Typ: 570nm; Mounting Type: SMD; Forward Current If Max: 20mA; Dominant Wavelength Typ: 572nm; LED Mounting: SMD; Operating Temperature Range: -30degCto+85degC; Operating Temperature Min: -30degC; Manufacturer URL: http://www.avagotech.com/; Packaging: CutTape; Luminous Intensity Typ: 15mcd; Package Reference: HSMX-C170; Storage Temperature Max: 85degC; Opto Case Style: SMD; Forward Voltage: 2.2V
J1 = CMP-12400-000001-1: RECEPTACLE, 20A, 4MM, PCB, SOLDER, RED; Manufacturer: Multicomp; Conn Orientation: Horizontal; Number Of Contacts: 1; Current Rating: 24A; Voltage Rating: 60V; Is Female: yes; ComponentLink2Description: Datasheet; Device Class L3: unset; Manufacturer Part Number: 24.243.1; RoHS: TRUE; Package: 24.243.1; ComponentLink2URL: https://datasheet.octopart.com/24.243.1-Multicomp-datasheet-38887736.pdf; Lead Free: Yes; Category: Conn; Height: 13mm; Device Class L2: unset; Device Class L1: Connectors; Contact Material: Silver; Automotive: No; Octopart: https://octopart.com/24.243.1-multicomp-57101049
J2 J4 = CMP-09586-000001-1: CONN TIP JACK SOLDER WHITE; Manufacturer: Cinch Connectivity; Manufacturer Part Number: 105-0751-001; Current Rating: 5A; Number Of Contacts: 1; Conn Orientation: Horizontal; Pitch: 10.16mm; Voltage Rating: 1500V; Is Female: yes; ComponentLink2URL: https://belfuse.com/resources/Johnson/drawings/dr-1050751001.pdf; RoHS: TRUE; ComponentLink2Description: Datasheet; Automotive: No; Temperature Range Low: -55°C; Digikey Description: CONN TIP JACK SOLDER WHITE; Device Class L2: unset; Octopart: https://octopart.com/105-0751-001-cinch+connectivity+solutions-51372833; Lead Free: Yes; Package: 105-0751-001; Device Class L3: unset; Contact Material: Silver; Temperature Range High: +75°C; Device Class L1: Connectors; Category: Conn; Height: 0.213inch; Temperature: -55°C to +75°C
J3 = CMP-12400-000002-1: RECEPTACLE, 20A, 4MM, PCB, SOLDER, BLACK; Manufacturer: Multicomp; Is Female: yes; Current Rating: 24A; Number Of Contacts: 1; Conn Orientation: Horizontal; Voltage Rating: 60V; Device Class L3: unset; Category: Conn; Contact Material: Silver; Octopart: https://octopart.com/24.243.2-multicomp-57101050; ComponentLink2URL: https://datasheet.octopart.com/24.243.2-Multicomp-datasheet-38887736.pdf; ComponentLink2Description: Datasheet; Automotive: No; Package: 24.243.2; Height: 13mm; Device Class L2: unset; Device Class L1: Connectors; Lead Free: Yes; Manufacturer Part Number: 24.243.2; RoHS: TRUE
J6-J13 = CMP-1502-00950-1: THT Vertical Pin Header WR-PHD, Pitch 1.27 mm, Dual Row, 16 pins; Manufacturer: Wurth Elektronik; Gender: Male; Working Voltage: 100VAC; Rated Current: 1A; Pin Number: 16; Pitch: 1.27mm; Contact Resistance: 20mOhm; Withstanding Voltage: 500VAC; Publisher: WurthElektronik; Package Reference: 62201621121; Part Number: 62201621121; Packaging: Box; Row Number: Dual; Mounting Technology: THT; Operating Temperature: -40to105degC; Manufacturer URL: http://www.we-online.de; Orientation: Vertical; Datasheet URL: https://katalog.we-online.de/em/datasheet/62201621121.pdf
J14 = CMP-14830-000005-1: CONN PWR JACK 2X5.5MM SOLDER; Manufacturer: CUI Inc; Conn Orientation: Right Angle; Shielding: true; Current Rating: 2.5A; Conn Gender: Male; Number Of Contacts: 3; Voltage Rating: 24V; Temperature Range High: +85°C; Manufacturer Part Number: PJ-047A; RoHS: TRUE; Height: 9.7mm; Octopart: https://octopart.com/pj-047a-cui-19052783; Digikey Description: CONN PWR JACK 2X5.5MM SOLDER; ComponentLink2URL: https://www.cui.com/product/resource/pj-047a.pdf; Lead Free: Yes; Device Class L1: Connectors; Contact Material: Tin,Nickel; Temperature: -25°C to +85°C; Temperature Range Low: -25°C; Automotive: No; Device Class L2: Power Connectors; Mouser Description: 2.0 x 6.0 mm, 2.5 A, Horizontal, Through Hole, Shielded, Dc Power Jack Connector; Package: PJ-047A; Category: Conn; ComponentLink2Description: Datasheet; Device Class L3: unset
M1 = XEM3001: XEM3001 Module Connector; Manufacturer: Generic Components; Revision: 20040624; Publisher: Opal Kelly; Class I: Connector
P1 P3-P6 P8 = CMP-1681-00004-4: Male Header, Pitch 2.54 mm, 1 x 2 Position, Height 8.38 mm, Tail Length 2.54 mm, -55 to 125 degC, RoHS, Bulk; Manufacturer: Samtec; Rows: 1; ComponentLink1URL: http://www.samtec.com/; Contact Finish: Gold; Mounting Technology: Through Hole; PackageReference: TSW-102-07-S-S; RoHSCompliant: true; Pins: 2; Contact Material: Bronze; ComponentLink2Description: Datasheet; Max Operating Temperature: 125 degC; Min Operating Temperature: -55 degC; Height: 8.38 mm; Packaging: Bulk; ComponentLink1Description: Manufacturer URL; PackageDescription: Male Header, Pitch 2.54 mm, 1 x 2 Position, Height 8.38 mm, Tail Length 2.54 mm; Colour: Black; Contact Plating: Gold; Length: 5.08 mm; ComponentLink2URL: http://suddendocs.samtec.com/catalog_english/tsw_th.pdf; DatasheetVersion: 12/2015; Mount: Through Hole; Lead Pitch: 0.1 inch; REACH SVHC: No SVHC; Package Quantity: 1
P2 P7 = CMP-1704-00001-3: Male Header, Pitch 2.54 mm, 1 x 2 Position, Height 10.67 mm, Tail Length 3.56 mm, 0 to 75 degC, RoHS, Bulk; Package Quantity: 3000; Height: 10.67 mm; RoHSCompliant: True; ComponentLink2URL: https://datasheet.ciiva.com/19454/232266-19454304.pdf; PartNumber: 22-23-2021; Packaging: Bulk; ComponentLink2Description: Datasheet; Min Operating Temperature: 0 degC; ComponentLink1Description: Manufacturer URL; Length: 5.08 mm; Mounting Technology: Through Hole; Max Operating Temperature: 75 degC; REACH SVHC: Unknown; PackageDescription: Male Header, Pitch 2.54 mm, 1 x 2 Position, Height 10.67 mm, Tail Length 3.56 mm; ComponentLink1URL: http://www.molex.com/; Mount: Through Hole; Radiation Hardening: No; Width: 6.35 mm; Pins: 2
Q1-Q3 = CMP-1258-00134-1: N-Channel Enhancement Mode MOS Transistor, 20 V, 1.05 A, -55 to 150 degC, 3-Pin SOT23, Tape and Reel; Manufacturer: NXP Semiconductors; VDS [max] (V): 20; Packing: Tape & Reel; ID [max] (A): 1.05; Channel Type: N; Ciss [typ] (pF): 152; Coss [typ] (pF): 71; Qr [typ] (nC): 19; VGSth [typ] (V): 0.57; PackageDescription: 3-Pin Small Outline Transistor Package, Body 2.9 x 1.3 mm, Pitch 0.95 mm; ComponentLink2URL: http://www.nxp.com/documents/data_sheet/BSH105.pdf; ComponentLink3Description: Package Specification; ComponentLink2Description: Datasheet; Mounting Technology: Surface Mount; ComponentLink3URL: http://www.nxp.com/documents/outline_drawing/sot023_po.pdf; PartNumber: BSH105,215; DatasheetVersion: Rev. 1.000; ComponentLink1Description: Manufacturer URL; ComponentLink1URL: http://www.nxp.com/; PackageVersion: 06-03-16, 03/2006; PackageReference: SOT23; Code_JEDEC: TO-236AB
R7 R9-R18 R20-R24 = CMP-2000-03820-1: Part Number: CRCW0603100KFKEA; Manufacturer: Vishay Dale
TP3-TP5 = CMP-2000-05181-1: Test Point, Black, 1-Pin THD, RoHS, Bulk; Manufacturer: Keystone; Other Names: 5001K; Catalog Drawings: 5000Series; Alternate Color: 5004K-ND / -TESTPOINTPCMINI.040"DYELLOW / 5003K-ND / -TESTPOINTPCMINI.040"DORANGE / 5002K-ND / -TESTPOINTPCMINI.040"DWHITE / 5000K-ND / -TESTPOINTPCMINI.040"DRED; Kits: DKTGRS232C-KIT-ND / -TTLCONVERTER; Online Catalog: ColorCodedTestPoints; Datasheet URL: https://ciiva.com/datasheet-click-2917627?src=ciiva&sig=bd195616; Mounting Type: 0.040"(1.02mm)HoleDiameter; Family: TestPoints; RoHS Information: RoHSComplianceStatement; Datasheet Version: Rev. G, 12/2008; Color: Black; Category: TestandMeasurement; Standard Package: 100; Manufacturer URL: http://www.keyelco.com/; Material: Base,Nylon46,UL94V-0; Type: PCTestPoint,Miniature; Terminal: 0.010"x0.020"(0.25mmx0.51mm)PhosphorBronzeWire,SilverPlated; Series: THM; Packaging: Bulk
TP6 = CMP-2000-05182-1: Test Point, White, 1-Pin THD, RoHS, Bulk; Manufacturer: KeystoneElectronics; Outside Diameter: 2.54mm; Plating: Silver; Mounting Hole Size: 1mm; Product: TestPoints; Packaging: Bulk; Manufacturer URL: http://www.keyelco.com/; Length: 7.62mm; Datasheet Version: Rev. G, 12/2008; Type: Miniature; Product Category: CircuitBoardHardware-PCB; Material: Nylon; RoHS: True; Contact Material: PhosphorBronze; Datasheet URL: https://ciiva.com/datasheet-click-2917627?src=ciiva&sig=bd195616; Color: White; Brand: KeystoneElectronics
U3 U6 = CMP-0244-00109-1: Fixed Low Drop Positive Voltage Regulator, 5V, 3-Pin DPAK, Tape and Reel; ComponentLink2URL: http://www.st.com/internet/com/TECHNICAL_RESOURCES/TECHNICAL_LITERATURE/DATASHEET/CD00000544.pdf; ComponentLink1URL: http://www.st.com; PackageReference: TO-252; DatasheetVersion: 1/11/2011; ComponentLink1Description: Manufacturer URL; PackageVersion: 2011; ComponentLink2Description: Datasheet; PackageDescription: 3-Pin Transistor Outline Package 2.28 mm Pitch, 9.7 mm Lead Span (DPAK)
U4 = CMP-0244-00088-1: Fixed Low Drop Positive Voltage Regulator, 3.3V, 3-Pin DPAK, Tape and Reel; ComponentLink1Description: Manufacturer URL; PackageVersion: 2011; PackageReference: TO-252; ComponentLink2Description: Datasheet; ComponentLink1URL: http://www.st.com; DatasheetVersion: 1/11/2011; PackageDescription: 3-Pin Transistor Outline Package 2.28 mm Pitch, 9.7 mm Lead Span (DPAK); ComponentLink2URL: http://www.st.com/internet/com/TECHNICAL_RESOURCES/TECHNICAL_LITERATURE/DATASHEET/CD00000544.pdf
U5 U7 = CMP-0330-00011-2: Low Input Voltage, 1.8 A Single Channel Load Switch with Controlled Turn-On, 1.8 V Logic Compatible, 1.8 A, 1.4 to 5.5 V, -40 to 85 degC, 6-pin SOT-23 (DBV), Green (RoHS & no Sb/Br); Manufacturer: Texas Instruments; Active High Enable: TRUE; Iin(nA): 10000; Output Rise Time(ÂµS): 4500; Imax(A): 1.8; Vin(V): 1.4 - 5.5; Control Logic: 1.8-V Logic Compatible; SubFamily: Non Current Limited Load Switch; HBM ESD(kV): 2; Quick Output Discharge Transistor: Yes; rON @1.8V(mOhm): 85; DatasheetVersion: SLVSB39; ComponentLink1URL: http://www.ti.com/general/docs/lit/getliterature.tsp?genericPartNumber=TPS22929D&fileType=pdf; Mounting Technology: Surface Mount; PackageDescription: 6-Pin Plastic Small-Outline Package, 2.9 x 1.6 mm Body, 0.95 mm Pitch, 2.8 mm Lead Span; PackageVersion: revK, Mar-2006; Code_JEDEC: MO-178-AB*; PartNumber: TPS22929DDBVR; PackageReference: DBV0006A; Eco-Plan: Green (RoHS & no Sb/Br); ComponentLink1Description: Datasheet